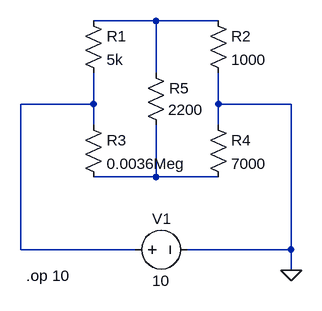
[diagram p0: schematic Fig-1.asc]
Fig-1.asc, the LTspice schematic file:
Version 4
SHEET 1 880 680
WIRE 208 -32 112 -32
WIRE 304 -32 208 -32
WIRE 208 48 208 -32
WIRE 112 96 112 48
WIRE 112 96 0 96
WIRE 304 96 304 48
WIRE 416 96 304 96
WIRE 112 128 112 96
WIRE 304 128 304 96
WIRE 208 208 208 128
WIRE 208 208 112 208
WIRE 304 208 208 208
WIRE 0 320 0 96
WIRE 176 320 0 320
WIRE 416 320 416 96
WIRE 416 320 256 320
WIRE 416 352 416 320
FLAG 416 352 0
SYMBOL res 192 32 R0
WINDOW 3 35 73 Left 2
SYMATTR Value 2200
SYMATTR InstName R5
SYMBOL res 96 112 R0
SYMATTR InstName R3
SYMATTR Value 0.0036Meg
SYMBOL res 288 112 R0
SYMATTR InstName R4
SYMATTR Value 7000
SYMBOL res 288 -48 R0
SYMATTR InstName R2
SYMATTR Value 1000
SYMBOL res 96 -48 R0
SYMATTR InstName R1
SYMATTR Value 5k
SYMBOL voltage 160 320 R270
WINDOW 0 32 57 VTop 2
WINDOW 3 -32 56 VBottom 2
SYMATTR InstName V1
SYMATTR Value 10
TEXT 8 360 Left 2 !.op 10

The netlist it stands for:
* Fig-1.asc
R5 N001 N003 2200
R3 N002 N003 0.0036Meg
R4 0 N003 7000
R2 N001 0 1000
R1 N001 N002 5k
V1 N002 0 10
.op 10
.backanno
.end